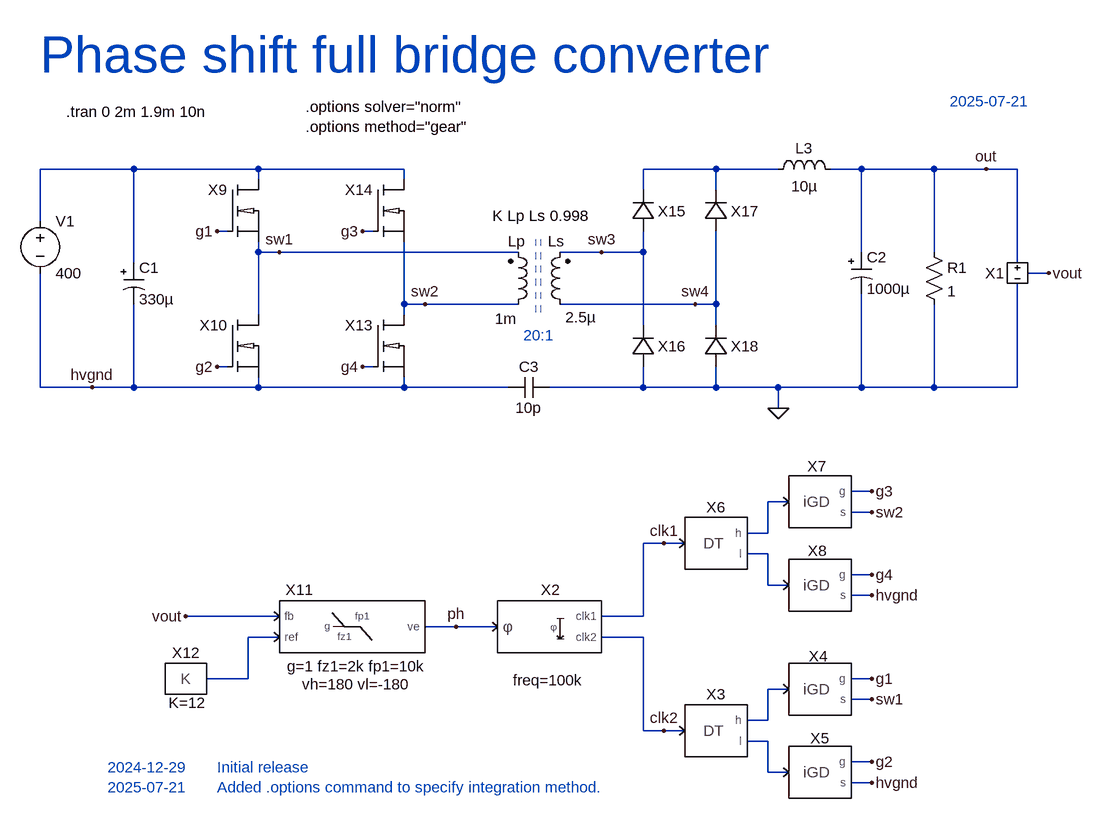
[diagram p0: schematic PSFB.asc]
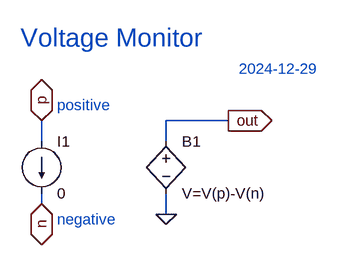
[diagram p1: sub-circuit vmon.asc]
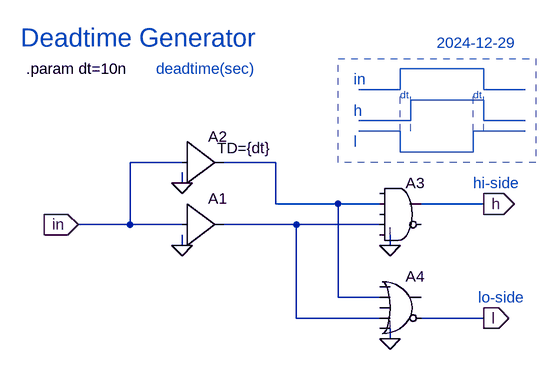
[diagram p2: sub-circuit deadtime.asc]
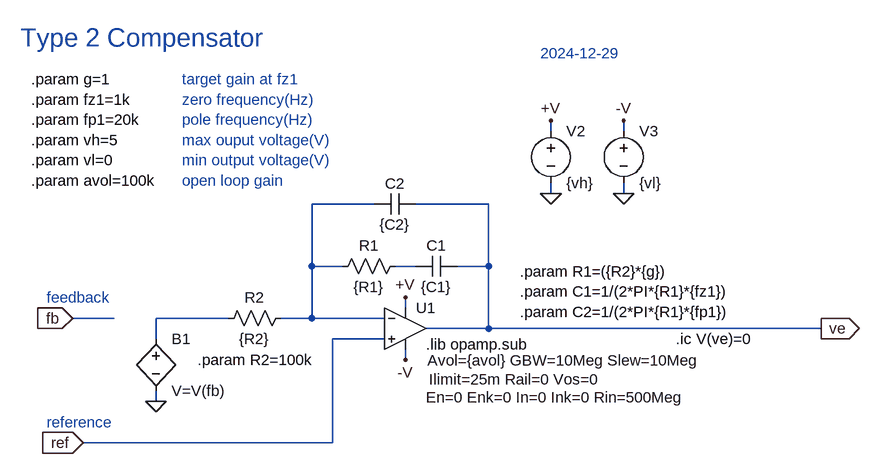
[diagram p3: sub-circuit type2.asc]
PSFB.asc, the LTspice schematic file:
Version 4.1
SHEET 1 1968 1000
WIRE 128 -16 -16 -16
WIRE 320 -16 128 -16
WIRE 544 -16 320 -16
WIRE 1024 -16 912 -16
WIRE 1120 -16 1024 -16
WIRE 1248 -16 1200 -16
WIRE 1360 -16 1248 -16
WIRE 1440 -16 1360 -16
WIRE 1488 -16 1440 -16
WIRE 320 0 320 -16
WIRE 544 0 544 -16
WIRE 912 16 912 -16
WIRE 1024 16 1024 -16
WIRE -16 64 -16 -16
WIRE 272 80 256 80
WIRE 496 80 480 80
WIRE 320 112 320 96
WIRE 352 112 320 112
WIRE 720 112 352 112
WIRE 848 112 784 112
WIRE 912 112 912 80
WIRE 912 112 848 112
WIRE 1248 112 1248 -16
WIRE 1360 112 1360 -16
WIRE 128 128 128 -16
WIRE 1488 128 1488 -16
WIRE 1536 144 1504 144
WIRE 544 192 544 96
WIRE 576 192 544 192
WIRE 720 192 576 192
WIRE 992 192 784 192
WIRE 1024 192 1024 80
WIRE 1024 192 992 192
WIRE 320 208 320 112
WIRE 544 208 544 192
WIRE 912 224 912 112
WIRE 1024 224 1024 192
WIRE 272 288 256 288
WIRE 496 288 480 288
WIRE -16 320 -16 144
WIRE 64 320 -16 320
WIRE 128 320 128 192
WIRE 128 320 64 320
WIRE 320 320 320 304
WIRE 320 320 128 320
WIRE 544 320 544 304
WIRE 544 320 320 320
WIRE 704 320 544 320
WIRE 912 320 912 288
WIRE 912 320 768 320
WIRE 1024 320 1024 288
WIRE 1024 320 912 320
WIRE 1120 320 1024 320
WIRE 1248 320 1248 176
WIRE 1248 320 1120 320
WIRE 1360 320 1360 192
WIRE 1360 320 1248 320
WIRE 1488 320 1488 160
WIRE 1488 320 1360 320
WIRE 1120 352 1120 320
WIRE 1264 480 1232 480
WIRE 1136 496 1104 496
WIRE 1264 512 1232 512
WIRE 1104 544 1104 496
WIRE 1104 544 1072 544
WIRE 944 560 912 560
WIRE 976 560 944 560
WIRE 1104 576 1072 576
WIRE 1264 608 1232 608
WIRE 1104 624 1104 576
WIRE 1136 624 1104 624
WIRE 1264 640 1232 640
WIRE 352 672 208 672
WIRE 912 672 912 560
WIRE 912 672 848 672
WIRE 624 688 576 688
WIRE 688 688 624 688
WIRE 352 704 304 704
WIRE 912 704 848 704
WIRE 304 768 304 704
WIRE 304 768 240 768
WIRE 1264 768 1232 768
WIRE 1136 784 1104 784
WIRE 1264 800 1232 800
WIRE 1104 832 1104 784
WIRE 1104 832 1072 832
WIRE 912 848 912 704
WIRE 944 848 912 848
WIRE 976 848 944 848
WIRE 1104 864 1072 864
WIRE 1264 896 1232 896
WIRE 1104 912 1104 864
WIRE 1136 912 1104 912
WIRE 1264 928 1232 928
FLAG 256 80 g1
FLAG 256 288 g2
FLAG 352 112 sw1
FLAG 480 80 g3
FLAG 480 288 g4
FLAG 576 192 sw2
FLAG 1440 -16 out
FLAG 1536 144 vout
FLAG 1264 768 g1
FLAG 1264 800 sw1
FLAG 1264 896 g2
FLAG 1264 480 g3
FLAG 1264 512 sw2
FLAG 1264 608 g4
FLAG 208 672 vout
FLAG 624 688 ph
FLAG 944 560 clk1
FLAG 944 848 clk2
FLAG 64 320 hvgnd
FLAG 1264 640 hvgnd
FLAG 1264 928 hvgnd
FLAG 848 112 sw3
FLAG 992 192 sw4
FLAG 1120 352 0
SYMBOL voltage -16 48 R0
WINDOW 123 0 0 Left 0
WINDOW 39 0 0 Left 0
SYMATTR InstName V1
SYMATTR Value 400
SYMBOL polcap 112 128 R0
WINDOW 3 24 56 Left 2
SYMATTR Value 330µ
SYMATTR InstName C1
SYMATTR Description Capacitor
SYMATTR Type cap
SYMATTR SpiceLine Irms=1.5 Rser=0.1
SYMBOL ind2 704 208 M180
WINDOW 0 0 113 Left 2
WINDOW 3 -20 -6 Left 2
SYMATTR InstName Lp
SYMATTR Value 1m
SYMATTR SpiceLine Rser=1m
SYMBOL ind2 800 208 R180
WINDOW 0 9 113 Left 2
WINDOW 3 -40 -4 Left 2
SYMATTR InstName Ls
SYMATTR Value 2.5µ
SYMATTR SpiceLine Rser=1m
SYMBOL ind 1104 0 R270
WINDOW 0 32 56 VTop 2
WINDOW 3 5 56 VBottom 2
SYMATTR InstName L3
SYMATTR Value 10µ
SYMATTR SpiceLine Rser=1m
SYMBOL polcap 1232 112 R0
WINDOW 3 24 56 Left 2
SYMATTR Value 1000µ
SYMATTR InstName C2
SYMATTR Description Capacitor
SYMATTR Type cap
SYMATTR SpiceLine Rser=0.1
SYMBOL VMON 1488 144 R0
SYMATTR InstName X1
SYMBOL DEADTIME 1024 848 R0
SYMATTR InstName X3
SYMBOL iGD 1184 784 R0
WINDOW 0 -2 -66 Top 2
SYMATTR InstName X4
SYMBOL iGD 1184 912 R0
WINDOW 0 0 -68 Top 2
SYMATTR InstName X5
SYMBOL DEADTIME 1024 560 R0
SYMATTR InstName X6
SYMBOL iGD 1184 496 R0
WINDOW 0 -5 -70 Top 2
SYMATTR InstName X7
SYMBOL iGD 1184 624 R0
WINDOW 0 -4 -68 Top 2
SYMATTR InstName X8
SYMBOL res 1344 96 R0
SYMATTR InstName R1
SYMATTR Value 1
SYMBOL TYPE2 464 688 R0
WINDOW 0 -81 -57 Center 2
WINDOW 39 7 61 Center 2
WINDOW 40 7 89 Center 2
SYMATTR InstName X11
SYMATTR SpiceLine g=1 fz1=2k fp1=10k
SYMATTR SpiceLine2 vh=180 vl=-180
SYMBOL CONST 208 768 R0
WINDOW 39 2 53 Bottom 2
SYMATTR SpiceLine K=12
SYMATTR InstName X12
SYMBOL PHASESHIFT 768 688 R0
WINDOW 0 1 -72 Top 2
WINDOW 39 -2 67 Top 2
SYMATTR InstName X2
SYMBOL iNMOS 320 48 R0
SYMATTR InstName X9
SYMBOL iNMOS 320 256 R0
SYMATTR InstName X10
SYMBOL iNMOS 544 256 R0
SYMATTR InstName X13
SYMBOL iNMOS 544 48 R0
SYMATTR InstName X14
SYMBOL iD 912 48 R180
SYMATTR InstName X15
SYMBOL iD 912 256 R180
SYMATTR InstName X16
SYMBOL iD 1024 48 R180
SYMATTR InstName X17
SYMBOL iD 1024 256 R180
SYMATTR InstName X18
SYMBOL cap 768 304 R90
WINDOW 0 0 32 VBottom 2
WINDOW 3 32 32 VTop 2
SYMATTR InstName C3
SYMATTR Value 10p
TEXT 680 56 Left 2 !K Lp Ls 0.998
TEXT 728 240 Left 2 ;20:1
TEXT 24 -104 Left 2 !.tran 0 2m 1.9m 10n
TEXT -16 -192 Left 6 ;Phase shift full bridge converter
TEXT 1384 -120 Left 2 ;2025-07-21
TEXT 392 -112 Left 2 !.options solver="norm"\n.options method="gear"
TEXT 88 904 Left 2 ;2024-12-29       Initial release\n2025-07-21       Added .options command to specify integration method.
LINE Normal 747 204 747 92 1
LINE Normal 755 204 755 92 1

vmon.asc, the sub-circuit schematic file:
Version 4
SHEET 1 880 680
WIRE 176 -32 80 -32
WIRE -112 0 -112 -32
WIRE 80 0 80 -32
WIRE -112 96 -112 80
WIRE 80 112 80 80
FLAG -112 -32 p
IOPIN -112 -32 BiDir
FLAG -112 96 n
IOPIN -112 96 BiDir
FLAG 176 -32 out
IOPIN 176 -32 Out
FLAG 80 112 0
SYMBOL bv 80 -16 R0
SYMATTR InstName B1
SYMATTR Value V=V(p)-V(n)
SYMBOL current -112 0 R0
WINDOW 123 0 0 Left 0
WINDOW 39 0 0 Left 0
SYMATTR InstName I1
SYMATTR Value 0
TEXT -144 -160 Left 4 ;Voltage Monitor
TEXT -88 -56 Left 2 ;positive
TEXT -88 120 Left 2 ;negative
TEXT 192 -112 Left 2 ;2024-12-29

deadtime.asc, the sub-circuit schematic file:
Version 4
SHEET 1 1412 1312
WIRE 64 288 -16 288
WIRE 208 288 128 288
WIRE 64 320 64 304
WIRE 208 352 208 288
WIRE 304 352 208 352
WIRE 368 352 304 352
WIRE 528 352 432 352
WIRE -16 384 -16 288
WIRE -16 384 -96 384
WIRE 64 384 -16 384
WIRE 240 384 128 384
WIRE 368 384 240 384
WIRE 64 416 64 400
WIRE 384 416 384 400
WIRE 304 496 304 352
WIRE 368 496 304 496
WIRE 240 528 240 384
WIRE 368 528 240 528
WIRE 528 528 432 528
WIRE 384 560 384 544
FLAG -96 384 in
IOPIN -96 384 In
FLAG 64 416 0
FLAG 64 320 0
FLAG 384 416 0
FLAG 384 560 0
FLAG 528 352 h
IOPIN 528 352 Out
FLAG 528 528 l
IOPIN 528 528 Out
SYMBOL Digital\\buf1 64 320 R0
SYMATTR InstName A1
SYMBOL Digital\\buf1 64 224 R0
WINDOW 3 54 42 Left 2
SYMATTR Value TD={dt}
SYMATTR InstName A2
SYMBOL Digital\\and 400 304 R0
SYMATTR InstName A3
SYMBOL Digital\\or 400 448 R0
SYMATTR InstName A4
TEXT -176 144 Left 2 !.param dt=10n
TEXT -184 96 Left 4 ;Deadtime Generator
TEXT 24 144 Left 2 ;deadtime(sec)
TEXT 512 320 Left 2 ;hi-side
TEXT 520 496 Left 2 ;lo-side
TEXT 328 160 Left 2 ;in
TEXT 328 208 Left 2 ;h
TEXT 328 256 Left 2 ;l
TEXT 400 184 Left 1 ;dt
TEXT 512 184 Left 1 ;dt
TEXT 456 104 Left 2 ;2024-12-29
LINE Normal 400 176 336 176
LINE Normal 400 176 400 144
LINE Normal 528 144 400 144
LINE Normal 528 176 528 144
LINE Normal 592 176 528 176
LINE Normal 416 224 336 224
LINE Normal 416 224 416 192
LINE Normal 528 192 416 192
LINE Normal 528 224 528 192
LINE Normal 592 224 528 224
LINE Normal 400 240 336 240
LINE Normal 400 272 400 240
LINE Normal 512 272 400 272
LINE Normal 512 272 512 240
LINE Normal 592 240 512 240
LINE Normal 400 240 400 176 2
LINE Normal 512 240 512 176 2
LINE Normal 416 240 416 176 2
LINE Normal 528 240 528 176 2
RECTANGLE Normal 608 288 304 128 2

type2.asc, the sub-circuit schematic file:
Version 4
SHEET 1 1008 680
WIRE 464 -144 464 -160
WIRE 576 -144 576 -160
WIRE 464 -48 464 -64
WIRE 576 -48 576 -64
WIRE 192 -32 96 -32
WIRE 368 -32 256 -32
WIRE 96 64 96 -32
WIRE 144 64 96 64
WIRE 256 64 224 64
WIRE 368 64 368 -32
WIRE 368 64 320 64
WIRE 240 128 240 112
WIRE -208 144 -272 144
WIRE -32 144 -144 144
WIRE 96 144 96 64
WIRE 96 144 48 144
WIRE 208 144 96 144
WIRE 368 160 368 64
WIRE 368 160 272 160
WIRE 880 160 368 160
WIRE -144 176 -144 144
WIRE 208 176 128 176
WIRE 240 208 240 192
WIRE -144 272 -144 256
WIRE 128 336 128 176
WIRE 128 336 -256 336
FLAG -272 144 fb
IOPIN -272 144 In
FLAG -256 336 ref
IOPIN -256 336 In
FLAG -144 272 0
FLAG 880 160 ve
IOPIN 880 160 Out
FLAG 576 -48 0
FLAG 464 -48 0
FLAG 464 -160 +V
FLAG 576 -160 -V
FLAG 240 112 +V
FLAG 240 208 -V
SYMBOL res 240 48 R90
WINDOW 0 0 56 VBottom 2
WINDOW 3 32 56 VTop 2
SYMATTR InstName R1
SYMATTR Value {R1}
SYMBOL cap 320 48 R90
WINDOW 0 0 32 VBottom 2
WINDOW 3 32 32 VTop 2
SYMATTR InstName C1
SYMATTR Value {C1}
SYMBOL cap 256 -48 R90
WINDOW 0 0 32 VBottom 2
WINDOW 3 32 32 VTop 2
SYMATTR InstName C2
SYMATTR Value {C2}
SYMBOL bv -144 160 R0
SYMATTR InstName B1
SYMATTR Value V=V(fb)
SYMBOL res 64 128 R90
WINDOW 0 0 56 VBottom 2
WINDOW 3 32 56 VTop 2
SYMATTR InstName R2
SYMATTR Value {R2}
SYMBOL UniversalOpAmp2 240 160 R0
WINDOW 123 34 49 Left 2
WINDOW 39 36 78 Left 2
WINDOW 40 32 106 Left 2
SYMATTR Value2 Avol={avol} GBW=10Meg Slew=10Meg
SYMATTR InstName U1
SYMBOL voltage 464 -160 R0
SYMATTR InstName V2
SYMATTR Value {vh}
SYMBOL voltage 576 -160 R0
SYMATTR InstName V3
SYMATTR Value {vl}
TEXT 272 184 Left 2 !.lib opamp.sub
TEXT -336 -224 Left 2 !.param g=1\n.param fz1=1k\n.param fp1=20k\n.param vh=5\n.param vl=0\n.param avol=100k
TEXT 416 72 Left 2 !.param R1=({R2}*{g})\n.param C1=1/(2*PI*{R1}*{fz1})\n.param C2=1/(2*PI*{R1}*{fp1})
TEXT -352 -288 Left 4 ;Type 2 Compensator
TEXT -80 208 Left 2 !.param R2=100k
TEXT -104 -224 Left 2 ;target gain at fz1\nzero frequency(Hz)\npole frequency(Hz)\nmax ouput voltage(V)\nmin output voltage(V)\nopen loop gain
TEXT -312 112 Left 2 ;feedback
TEXT -312 304 Left 2 ;reference
TEXT 656 176 Left 2 !.ic V(ve)=0
TEXT 448 -264 Left 2 ;2024-12-29

The netlist it stands for:
* PSFB.asc
V1 N001 hvgnd 400
C1 N001 hvgnd 330µ Irms=1.5 Rser=0.1
Lp sw2 sw1 1m Rser=1m
Ls sw4 sw3 2.5µ Rser=1m
L3 N002 out 10µ Rser=1m
C2 out 0 1000µ Rser=0.1
X§X1 0 vout out vmon
X§X3 clk2 N007 N006 deadtime params: dt=10n
X§X4 N006 g1 sw1 iGD  ; pins in g s
X§X5 N007 g2 hvgnd iGD  ; pins in g s
X§X6 clk1 N004 N003 deadtime params: dt=10n
X§X7 N003 g3 sw2 iGD  ; pins in g s
X§X8 N004 g4 hvgnd iGD  ; pins in g s
R1 out 0 1
X§X11 vout N005 ph type2 params: avol=100k g=1 fz1=2k fp1=10k vh=180 vl=-180
X§X12 N005 CONST K=12  ; pins K
X§X2 ph clk1 clk2 PHASESHIFT freq=100k  ; pins phase clk1 clk2
X§X9 N001 g1 sw1 iNMOS params: esl=1f rsnb=1k csnb=10p ron=10m  ; pins D G S
X§X10 sw1 g2 hvgnd iNMOS params: esl=1f rsnb=1k csnb=10p ron=10m  ; pins D G S
X§X13 sw2 g4 hvgnd iNMOS params: esl=1f rsnb=1k csnb=10p ron=10m  ; pins D G S
X§X14 N001 g3 sw2 iNMOS params: esl=1f rsnb=1k csnb=10p ron=10m  ; pins D G S
X§X15 sw3 N002 iD params: von=1n ron=10m esl=1f rsnb=1k csnb=10p  ; pins AN CA
X§X16 0 sw3 iD params: von=1n ron=10m esl=1f rsnb=1k csnb=10p  ; pins AN CA
X§X17 sw4 N002 iD params: von=1n ron=10m esl=1f rsnb=1k csnb=10p  ; pins AN CA
X§X18 0 sw4 iD params: von=1n ron=10m esl=1f rsnb=1k csnb=10p  ; pins AN CA
C3 0 hvgnd 10p

* block symbol definitions
.subckt vmon n out p
B1 out 0 V=V(p)-V(n)
I1 p n 0
* Voltage Monitor
* positive
* negative
* 2024-12-29
.ends vmon

.subckt deadtime in l h
A1 in 0 0 0 0 0 N002 0 BUF
A2 in 0 0 0 0 0 N001 0 BUF TD={dt}
A3 0 N001 0 N002 0 0 h 0 AND
A4 0 N001 0 N002 0 l 0 0 OR
.param dt=10n
* Deadtime Generator
* deadtime(sec)
* hi-side
* lo-side
* in
* h
* l
* dt
* dt
* 2024-12-29
.ends deadtime

.subckt type2 fb ref ve
R1 N002 N001 {R1}
C1 ve N002 {C1}
C2 ve N001 {C2}
B1 N003 0 V=V(fb)
R2 N001 N003 {R2}
XU1 ref N001 +V -V ve level2 Avol={avol} GBW=10Meg Slew=10Meg Ilimit=25m Rail=0 Vos=0 En=0 Enk=0 In=0 Ink=0 Rin=500Meg  ; pins In+ In- V+ V- OUT
V2 +V 0 {vh}
V3 -V 0 {vl}
.lib opamp.sub
.param g=1
.param fz1=1k
.param fp1=20k
.param vh=5
.param vl=0
.param avol=100k
.param R1=({R2}*{g})
.param C1=1/(2*PI*{R1}*{fz1})
.param C2=1/(2*PI*{R1}*{fp1})
* Type 2 Compensator
.param R2=100k
* target gain at fz1
* zero frequency(Hz)
* pole frequency(Hz)
* max ouput voltage(V)
* min output voltage(V)
* open loop gain
* feedback
* reference
.ic V(ve)=0
* 2024-12-29
.ends type2

K Lp Ls 0.998
* 20:1
.tran 0 2m 1.9m 10n
* Phase shift full bridge converter
* 2025-07-21
.options solver="norm"
.options method="gear"
* 2024-12-29       Initial release
* 2025-07-21       Added .options command to specify integration method.
.lib UniversalOpAmp2.lib
.backanno
.end